# EAGLE schematic MethaneFlux - Copy (EAGLE 9.6.2)
Assembly variants: v1.0

## Sheet 1 of 2: Board 1- Power Module, Arduino MRK NB 1500, Methane Sensors (2600 2602 2611)
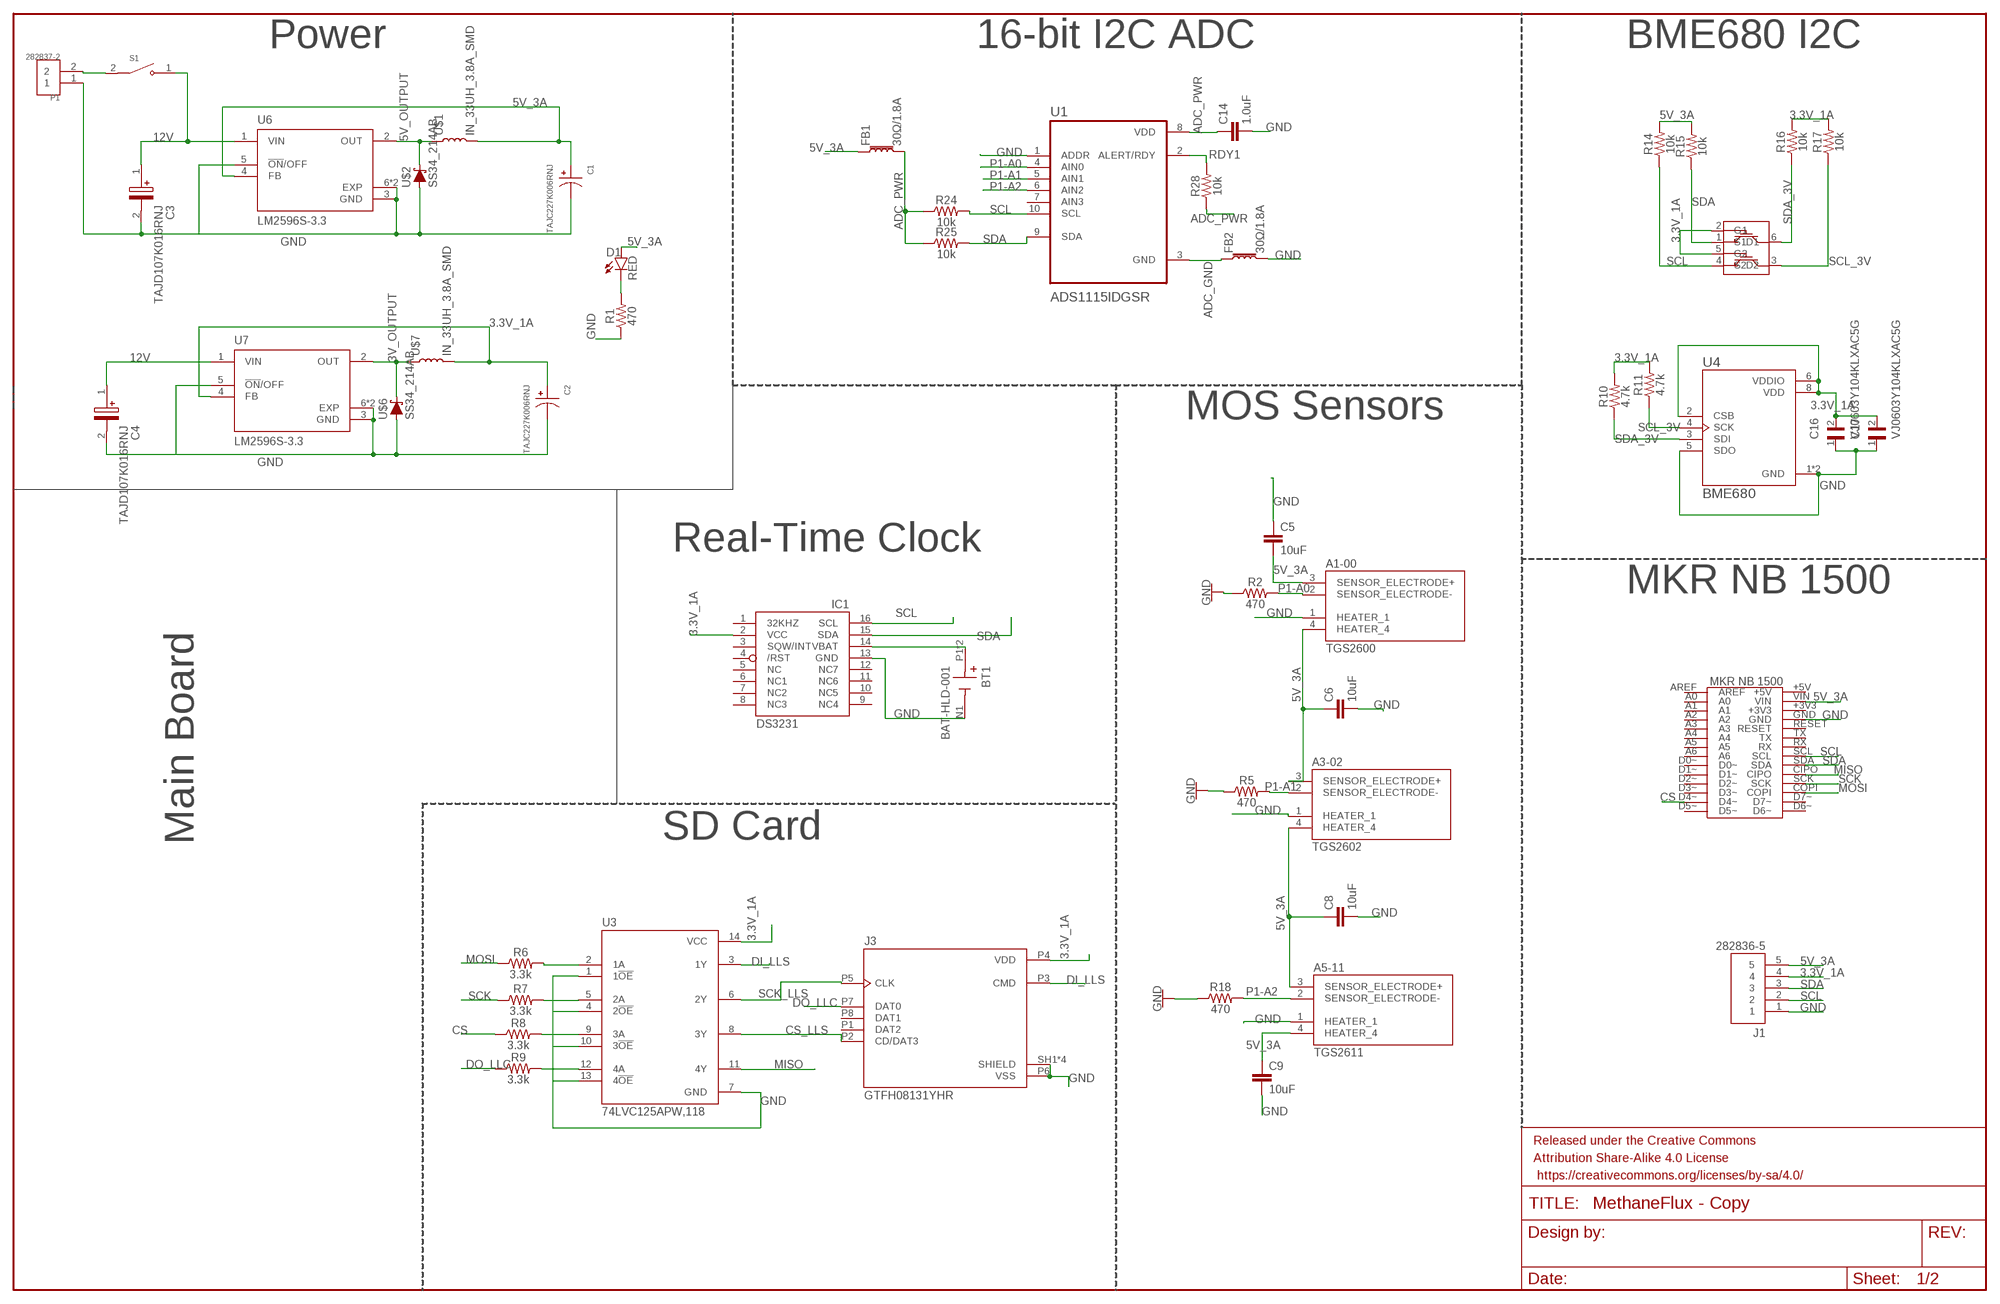
[diagram p0: schematic, sheet 1]

### Parts
A1-00  TGS2600  [TO255P920H830-4]
A3-02  TGS2602  [TGS2602]
A5-11  TGS2611  [TGS2611]
BT1  BAT-HLD-001  [BAT_BAT-HLD-001]
C1  TAJC227K006RNJ  [CAPPM6032X280N]
C2  TAJC227K006RNJ  [CAPPM6032X280N]
C3  TAJD107K016RNJ  [CAPPM7344X310N]
C4  TAJD107K016RNJ  [CAPPM7344X310N]
C5  10uF  10UF-0603-6.3V-20%  [0603]
C6  10uF  10UF-0603-6.3V-20%  [0603]
C8  10uF  10UF-0603-6.3V-20%  [0603]
C9  10uF  10UF-0603-6.3V-20%  [0603]
C14  1.0uF  1.0UF-0603-16V-10%  [0603]
C16  VJ0603Y104KLXAC5G  [CAPC1608X92N]
C17  VJ0603Y104KLXAC5G  [CAPC1608X92N]
D1  RED  LED-RED0603  [LED-0603]
FB1  30Ω/1.8A  FERRITE_BEAD-0603  [0603]
FB2  30Ω/1.8A  FERRITE_BEAD-0603  [0603]
FRAME1  FRAME-LEDGER  [CREATIVE_COMMONS]
IC1  DS3231/SO  [SO16W]
J1  282836-5  [TE_282836-5]
J3  GTFH08131YHR  [AMPHENOL_GTFH08131YHR]
P1  282837-2  [TE_282837-2]
R1  470  470OHM-0603-1/10W-1%  [0603]
R2  470  470OHM-0603-1/10W-1%  [0603]
R5  470  470OHM-0603-1/10W-1%  [0603]
R6  3.3k  3.3KOHM-0603-1/10W-1%  [0603]
R7  3.3k  3.3KOHM-0603-1/10W-1%  [0603]
R8  3.3k  3.3KOHM-0603-1/10W-1%  [0603]
R9  3.3k  3.3KOHM-0603-1/10W-1%  [0603]
R10  4.7k  4.7KOHM-0603-1/10W-1%  [0603]
R11  4.7k  4.7KOHM-0603-1/10W-1%  [0603]
R14  10k  10KOHM-0603-1/10W-1%  [0603]
R15  10k  10KOHM-0603-1/10W-1%  [0603]
R16  10k  10KOHM-0603-1/10W-1%  [0603]
R17  10k  10KOHM-0603-1/10W-1%  [0603]
R18  470  470OHM-0603-1/10W-1%  [0603]
R24  10k  10KOHM-0603-1/10W-1%  [0603]
R25  10k  10KOHM-0603-1/10W-1%  [0603]
R28  10k  10KOHM-0603-1/10W-1%  [0603]
S1  RB141C1100  [SW_RB141C1100]
U1  ADS1115IDGSR  [SOP50P490X110-10N]
U3  74LVC125APW,118  [IC_74LVC125APW,118]
U4  BME680  [PSON80P300X300X100-8N]
U6  LM2596S-3.3  [VREG_LM2596S-3.3]
U7  LM2596S-3.3  [VREG_LM2596S-3.3]
U$1  IN_33UH_3.8A_SMD  [INDUCTOR_4X4MM]
U$2  SS34_214AB  [SOD-323]
U$3  2N7002DW  [SOT363]
U$5  MKRNB1500  [MRKNB1500]
U$6  SS34_214AB  [SOD-323]
U$7  IN_33UH_3.8A_SMD  [INDUCTOR_4X4MM]

### Nets
3.3V_1A: C2.1 C16.2 C17.2 IC1.2(VCC) J1.4 J3.P4(VDD) R10.2 R11.2 R16.2 R17.2 U3.14(VCC) U4.2(CSB) U4.6(VDDIO) U4.8(VDD) U7.4(FB) U$3.2(G1) U$3.5(G2) U$7.P$2
3V_OUTPUT: U7.2(OUT) U$6.ANODE(C) U$7.P$1
5V_3A [5$3v3_3A]: A1-00.3(SENSOR_ELECTRODE+) A1-00.4(HEATER_4) A3-02.3(SENSOR_ELECTRODE+) A3-02.4(HEATER_4) A5-11.3(SENSOR_ELECTRODE+) A5-11.4(HEATER_4) C1.1 C5.2 C6.1 C8.1 C9.1 D1.A FB1.1 J1.5 R14.2 R15.2 U6.4(FB) U$1.P$2 U$5.VIN
5V_OUTPUT: U6.2(OUT) U$1.P$1 U$2.ANODE(C)
12V [PowerIn]: C3.1(+) C4.1(+) S1.1 U6.1(VIN) U7.1(VIN)
ADC_GND: FB2.1 U1.3(GND)
ADC_PWR: C14.1 FB1.2 R24.1 R25.1 R28.1 U1.8(VDD)
CS [SPI]: R8.1 U$5.D4~
CS_LLS [SPI]: J3.P2(CD/DAT3) U3.8(3Y)
DI_LLS [SPI]: J3.P3(CMD) U3.3(1Y)
DO_LLC [SPI]: J3.P7(DAT0) R9.1
GND [GND]: A1-00.1(HEATER_1) A3-02.1(HEATER_1) A5-11.1(HEATER_1) BT1.N1(-) C1.2 C2.2 C3.2(-) C4.2(-) C5.1 C6.2 C8.2 C9.2 C14.2 C16.1 C17.1 FB2.2 IC1.13(GND) J1.1 J3.P6(VSS) J3.SH1(SHIELD) J3.SH2(SHIELD) J3.SH3(SHIELD) J3.SH4(SHIELD) P1.1 R1.1 R2.1 R5.1 R18.1 U1.1(ADDR) U3.1(1!OE) U3.4(2!OE) U3.7(GND) U3.10(3!OE) U3.13(4!OE) U4.1(GND) U4.5(SDO) U4.7(GND) U6.3(GND) U6.5(!ON!/OFF) U6.6(EXP) U6.7(EXP) U7.3(GND) U7.5(!ON!/OFF) U7.6(EXP) U7.7(EXP) U$2.CATHODE(A) U$5.GND U$6.CATHODE(A)
MISO [SPI]: U3.11(4Y) U$5.CIPO
MOSI [SPI]: R6.1 U$5.COPI
N$3: R6.2 U3.2(1A)
N$4 [PowerIn]: P1.2 S1.2
N$6 [SPI]: R7.2 U3.5(2A)
N$7 [SPI]: R8.2 U3.9(3A)
N$8 [SPI]: R9.2 U3.12(4A)
N$10: BT1.P1(+) BT1.P2(+) IC1.14(VBAT)
N$11 [5$3v3_3A]: D1.C R1.2
P1-A0 [ADC]: A1-00.2(SENSOR_ELECTRODE-) R2.2 U1.4(AIN0)
P1-A1 [ADC]: A3-02.2(SENSOR_ELECTRODE-) R5.2 U1.5(AIN1)
P1-A2 [ADC]: A5-11.2(SENSOR_ELECTRODE-) R18.2 U1.6(AIN2)
RDY1: R28.2 U1.2(ALERT/RDY)
SCK [SPI]: R7.1 U$5.SCK
SCK_LLS [SPI]: J3.P5(CLK) U3.6(2Y)
SCL: IC1.16(SCL) J1.2 R14.1 R24.2 U1.10(SCL) U$3.4(S2) U$5.SCL
SCL_3V: R11.1 R17.1 U4.4(SCK) U$3.3(D2)
SDA: IC1.15(SDA) J1.3 R15.1 R25.2 U1.9(SDA) U$3.1(S1) U$5.SDA
SDA_3V: R10.1 R16.1 U4.3(SDI) U$3.6(D1)
Unconnected: IC1.1(32KHZ) IC1.3(SQW/INT) IC1.4(/RST) IC1.5(NC) IC1.6(NC1) IC1.7(NC2) IC1.8(NC3) IC1.9(NC4) IC1.10(NC5) IC1.11(NC6) IC1.12(NC7) J3.P1(DAT2) J3.P8(DAT1) U1.7(AIN3) U$5.+3V3 U$5.+5V U$5.A0 U$5.A1 U$5.A2 U$5.A3 U$5.A4 U$5.A5 U$5.A6 U$5.AREF U$5.D0~ U$5.D1~ U$5.D2~ U$5.D3~ U$5.D5~ U$5.D6~ U$5.D7~ U$5.RESET U$5.RX U$5.TX

### Notes on the sheet
- Power | 16-bit I2C ADC | BME680 I2C
- MOS Sensors
- Real-Time Clock
- MKR NB 1500
- Main Board | SD Card

## Sheet 2 of 2: Breakoff part to board 1- Methane Sensors (2600 2602 2611) and the ADC & BME
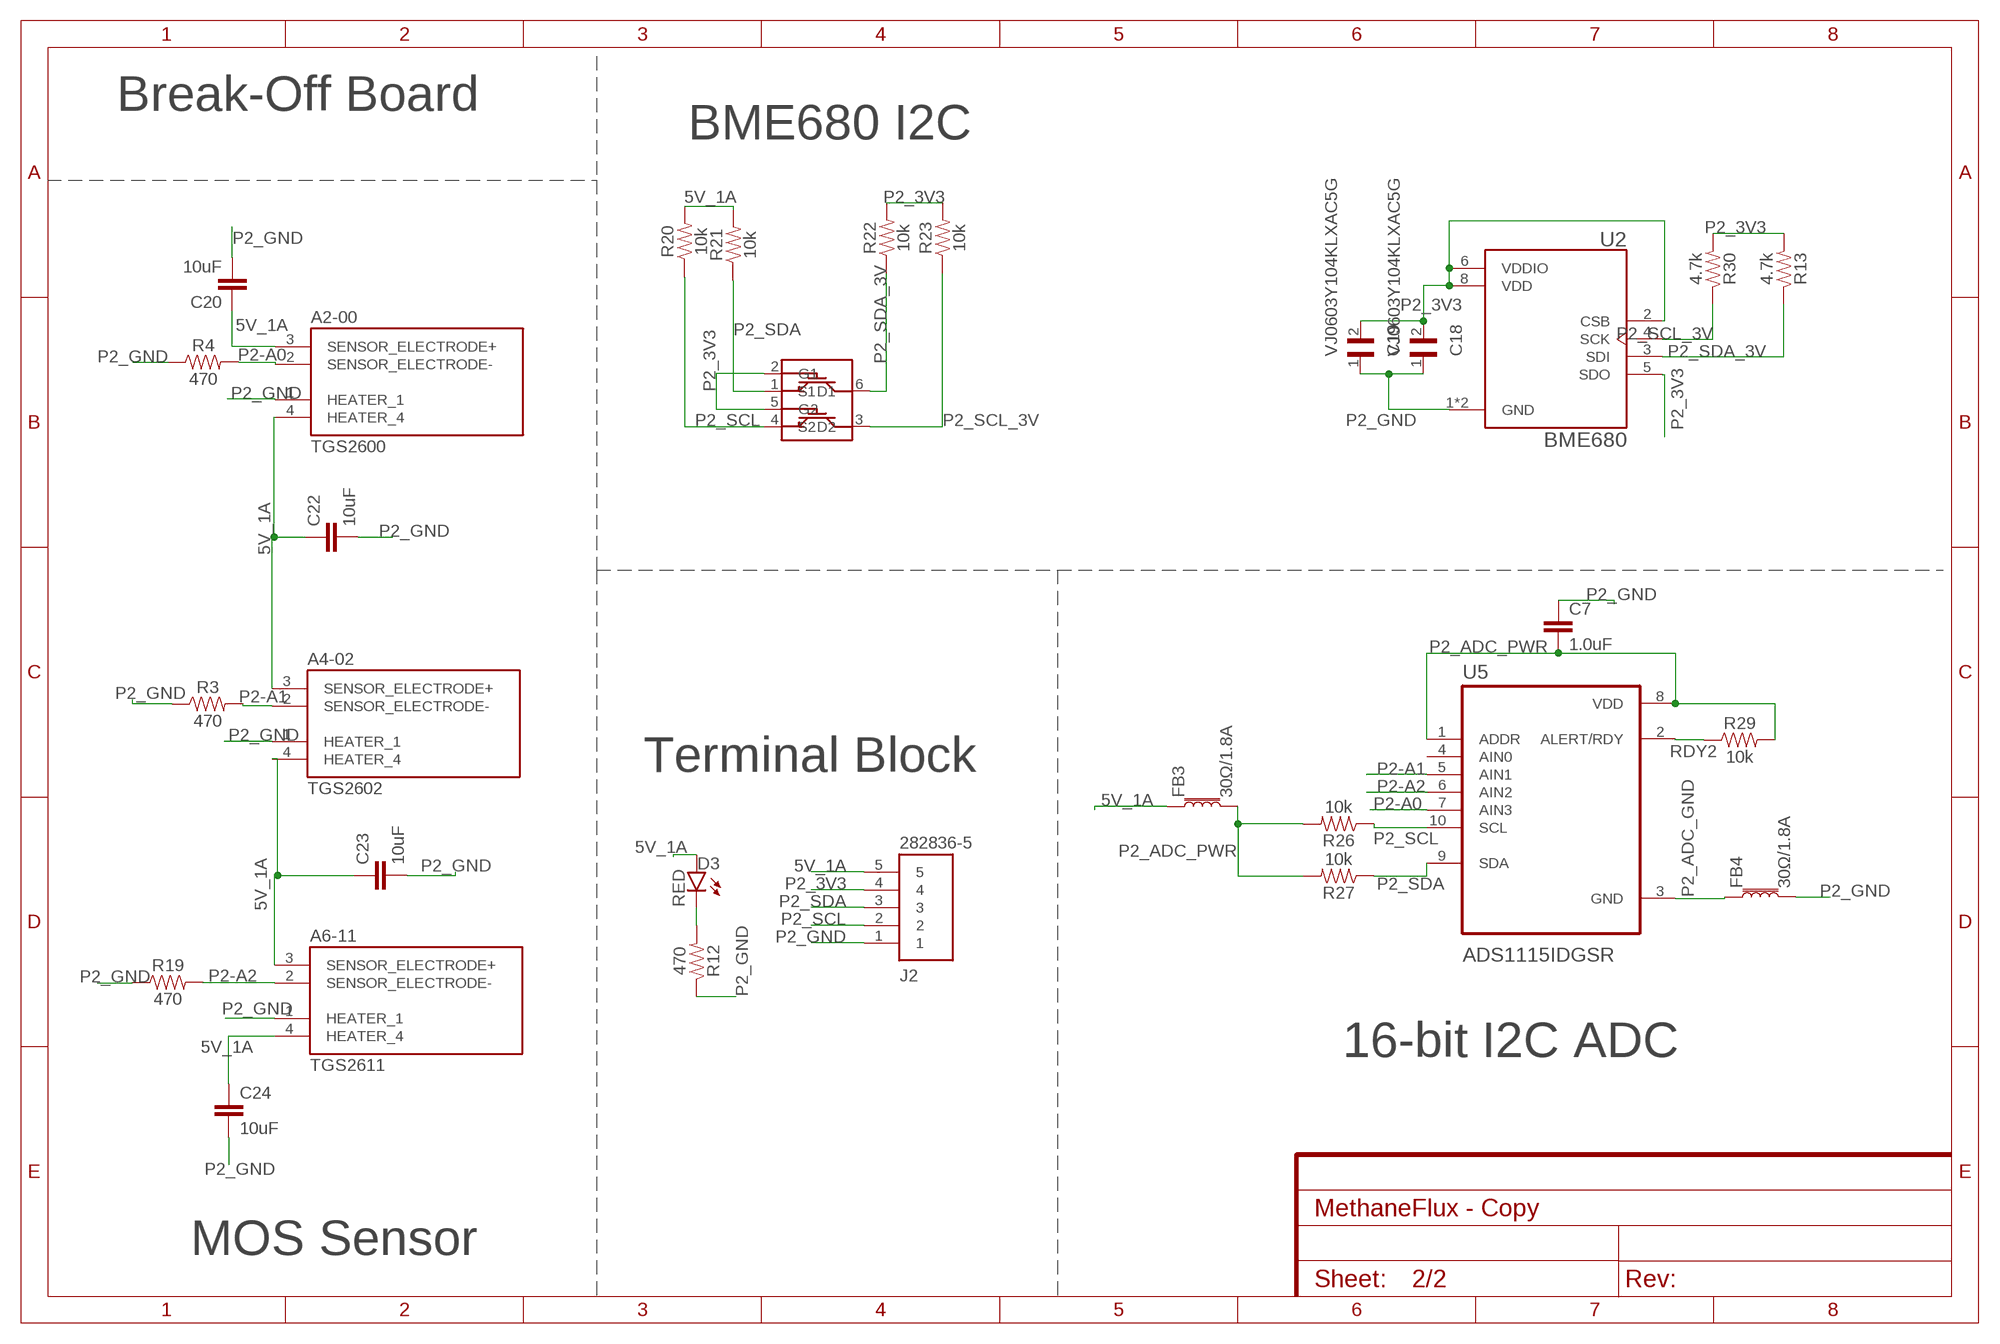
[diagram p1: schematic, sheet 2]

### Parts
A2-00  TGS2600  [TO255P920H830-4]
A4-02  TGS2602  [TGS2602]
A6-11  TGS2611  [TGS2611]
C7  1.0uF  1.0UF-0603-16V-10%  [0603]
C18  VJ0603Y104KLXAC5G  [CAPC1608X92N]
C19  VJ0603Y104KLXAC5G  [CAPC1608X92N]
C20  10uF  10UF-0603-6.3V-20%  [0603]
C22  10uF  10UF-0603-6.3V-20%  [0603]
C23  10uF  10UF-0603-6.3V-20%  [0603]
C24  10uF  10UF-0603-6.3V-20%  [0603]
D3  RED  LED-RED0603  [LED-0603]
FB3  30Ω/1.8A  FERRITE_BEAD-0603  [0603]
FB4  30Ω/1.8A  FERRITE_BEAD-0603  [0603]
J2  282836-5  [TE_282836-5]
R3  470  470OHM-0603-1/10W-1%  [0603]
R4  470  470OHM-0603-1/10W-1%  [0603]
R12  470  470OHM-0603-1/10W-1%  [0603]
R13  4.7k  4.7KOHM-0603-1/10W-1%  [0603]
R19  470  470OHM-0603-1/10W-1%  [0603]
R20  10k  10KOHM-0603-1/10W-1%  [0603]
R21  10k  10KOHM-0603-1/10W-1%  [0603]
R22  10k  10KOHM-0603-1/10W-1%  [0603]
R23  10k  10KOHM-0603-1/10W-1%  [0603]
R26  10k  10KOHM-0603-1/10W-1%  [0603]
R27  10k  10KOHM-0603-1/10W-1%  [0603]
R29  10k  10KOHM-0603-1/10W-1%  [0603]
R30  4.7k  4.7KOHM-0603-1/10W-1%  [0603]
U2  BME680  [PSON80P300X300X100-8N]
U5  ADS1115IDGSR  [SOP50P490X110-10N]
U$4  2N7002DW  [SOT363]

### Nets
5V_1A [P2_PWR]: A2-00.3(SENSOR_ELECTRODE+) A2-00.4(HEATER_4) A4-02.3(SENSOR_ELECTRODE+) A4-02.4(HEATER_4) A6-11.3(SENSOR_ELECTRODE+) A6-11.4(HEATER_4) C20.1 C22.1 C23.1 C24.1 D3.A FB3.1 J2.5 R20.2 R21.2
N$1 [5$3v3_3A]: D3.C R12.2
P2-A0 [ADC]: A2-00.2(SENSOR_ELECTRODE-) R4.2 U5.7(AIN3)
P2-A1 [ADC]: A4-02.2(SENSOR_ELECTRODE-) R3.2 U5.5(AIN1)
P2-A2 [ADC]: A6-11.2(SENSOR_ELECTRODE-) R19.2 U5.6(AIN2)
P2_3V3 [P2_PWR]: C18.2 C19.2 J2.4 R13.2 R22.2 R23.2 R30.2 U2.2(CSB) U2.5(SDO) U2.6(VDDIO) U2.8(VDD) U$4.2(G1) U$4.5(G2)
P2_ADC_GND: FB4.1 U5.3(GND)
P2_ADC_PWR: C7.2 FB3.2 R26.2 R27.2 R29.2 U5.1(ADDR) U5.8(VDD)
P2_GND [P2_GND]: A2-00.1(HEATER_1) A4-02.1(HEATER_1) A6-11.1(HEATER_1) C7.1 C18.1 C19.1 C20.2 C22.2 C23.2 C24.2 FB4.2 J2.1 R3.1 R4.1 R12.1 R19.1 U2.1(GND) U2.7(GND)
P2_SCL: J2.2 R20.1 R26.1 U5.10(SCL) U$4.4(S2)
P2_SCL_3V: R23.1 R30.1 U2.4(SCK) U$4.3(D2)
P2_SDA: J2.3 R21.1 R27.1 U5.9(SDA) U$4.1(S1)
P2_SDA_3V: R13.1 R22.1 U2.3(SDI) U$4.6(D1)
RDY2: R29.1 U5.2(ALERT/RDY)
Unconnected: U5.4(AIN0)

### Notes on the sheet
- Break-Off Board
- BME680 I2C
- Terminal Block
- 16-bit I2C ADC
- MOS Sensor

## Library data of the parts
A1-00 A2-00 = TGS2600:TGS2600: Check availability <https://pricing.snapeda.com/parts/TGS2600/Figaro/view-part?ref=eda>; AVAILABILITY: In Stock; CHECK_PRICES: https://www.snapeda.com/parts/TGS2600/Figaro/view-part/?ref=eda; DESCRIPTION: Gas sensor [Figaro] TGS2600 Gas sensor; MF: Figaro; MP: TGS2600; PACKAGE: None; PRICE: None; SNAPEDA_LINK: https://www.snapeda.com/parts/TGS2600/Figaro/view-part/?ref=snap
A3-02 A4-02 = TGS2600:TGS2602
A5-11 A6-11 = TGS2600:TGS2611
BT1 = BAT-HLD-001:BAT-HLD-001: Battery Retainer Coin, 20.0mm 1 Cell SMD (SMT) Tab Check availability <https://pricing.snapeda.com/parts/BAT-HLD-001/Linx%20Technologies/view-part?ref=eda>; AVAILABILITY: In Stock; CHECK_PRICES: https://www.snapeda.com/parts/BAT-HLD-001/Linx+Technologies+Inc./view-part/?ref=eda; DESCRIPTION: Holder for CR2032 and CR2025 Batteries, Surface-Mount, Bulk Packaging; MF: Linx Technologies; MP: BAT-HLD-001; PACKAGE: None; PRICE: None; PURCHASE-URL: https://www.snapeda.com/api/url_track_click_mouser/?unipart_id=184402&manufacturer=Linx Technologies&part_name=BAT-HLD-001&search_term=cr2032 battery holder; SNAPEDA_LINK: https://www.snapeda.com/parts/BAT-HLD-001/Linx+Technologies+Inc./view-part/?ref=snap
C1 C2 = TAJC227K006RNJ:TAJC227K006RNJ: 220µF Molded Tantalum Capacitors 16V 2312 (6032 Metric) 500mOhm; CHECK_PRICES: https://www.snapeda.com/parts/TAJC227K006RNJ/Kyocera/view-part/?ref=eda; DESCRIPTION: Cap Tant Solid 220uF 6.3V C CASE 10% (6 X 3.2 X 2.6mm) Inward L SMD 6032-28 1.2 Ohm 125°C T/R; DIGIKEY_PART_NUMBER: 478-1713-2-ND; MF: KYOCERA AVX; MP: TAJC227K006RNJ; PACKAGE: None; PURCHASE-URL: https://www.snapeda.com/api/url_track_click_mouser/?unipart_id=11870375&manufacturer=KYOCERA AVX&part_name=TAJC227K006RNJ&search_term=tajc227k006rnj; SNAPEDA_LINK: https://www.snapeda.com/parts/TAJC227K006RNJ/Kyocera/view-part/?ref=snap
C3 C4 = TAJD107K016RNJ:TAJD107K016RNJ: TAJ SMT tant capacitor,Case D,16V,100uF AVX 100uF SMD Solid MnO2 Tantalum Electrolytic Capacitor, 16 V dc /-10%, TAJ Series Source: Datasheet <http://datasheets.avx.com/TAJ.pdf>; CHECK_PRICES: https://www.snapeda.com/parts/TAJD107K016RNJ/AVX/view-part/?ref=eda; DESCRIPTION: Capacitor;Tantalum;Cap 100 uF;Tol 10%;Vol-Rtg 16 VDC;SMT;7343;ESR 0.9 Ohms;TR | AVX TAJD107K016RNJ; MF: AVX; MP: TAJD107K016RNJ; PACKAGE: 2917 AVX; RS_COMPONENTS_70001054_PURCHASE_URL: https://www.snapeda.com/api/url_track_click/https%253A//us.rs-online.com/product/avx/tajd107k016rnj/70001054/%253Futm_source%253DSnapEDA%2526utm_medium%253Dpart_sourcing%2526utm_campaign%253Dpartsourcing_SnapEDA_IMP_EX_GR/?unipart_id=320527&manufacturer=AVX&part_name=TAJD107K016RNJ&search_term=tajd107k016rnj; SNAPEDA_LINK: https://www.snapeda.com/parts/TAJD107K016RNJ/AVX/view-part/?ref=snap
C5 C6 C8 C9 C20 C22-C24 = SparkFun-Capacitors:10UF: 10.0µF ceramic capacitors A capacitor is a passive two-terminal electrical component used to store electrical energy temporarily in an electric field.; PROD_ID: CAP-11015
C7 C14 = SparkFun-Capacitors:1.0UF: 1µF ceramic capacitors A capacitor is a passive two-terminal electrical component used to store electrical energy temporarily in an electric field.; PROD_ID: CAP-00868
C16-C19 = VJ0603Y104KLXAC5G:VJ0603Y104KLXAC5G: Multilayer Ceramic Capacitors MLCC - SMD/SMT 100nF 25volts 10% Check availability <https://pricing.snapeda.com/parts/VJ0603Y104KLXAC5G/Vishay/view-part?ref=eda>; AVAILABILITY: In Stock; CHECK_PRICES: https://www.snapeda.com/parts/VJ0603Y104KLXAC5G/Vishay/view-part/?ref=eda; DESCRIPTION: Multilayer Ceramic Capacitors MLCC - SMD/SMT 100nF 25volts 10%; MF: Vishay; MP: VJ0603Y104KLXAC5G; PACKAGE: 0603 Vishay; PRICE: None; SNAPEDA_LINK: https://www.snapeda.com/parts/VJ0603Y104KLXAC5G/Vishay/view-part/?ref=snap
D1 D3 = SparkFun-LED:LED-RED: Red SMD LED Used in manufacturing of most products at SparkFun Packages: 0603 - SMD 0603 package [Product Link] <http://docs.avagotech.com/docs/AV02-0551EN> 0603 SMART - SMD 0603 SMART package ( more efficient and expensive)[Product Link] <http://www.osram-os.com/Graphics/XPic2/00077099_0.pdf> 1206 - SMD1206 package [Product Link] <https://www.sparkfun.com/datasheets/DevTools/LilyPad/Q150OVS4.pdff> SparkFun Products: Pro Mini 328 -5V <https://www.sparkfun.com/products/821> RedBoard <https://www.sparkfun.com/products/12757> IOIO-OTG <https://www.sparkfun.com/products/13613>; PROD_ID: DIO-00819
FB1-FB4 = SparkFun-Coils:FERRITE_BEAD: Ferrite Bead (blocks, cores, rings, chokes, etc.) Inductor with layers of ferrite used to suppress high frequencies. Often used to isolate high frequency noise. SparkFun Products: IOIO-OTG - V2.2 <https://www.sparkfun.com/products/13613> SparkFun SAMD21 Mini Breakout <https://www.sparkfun.com/products/13664> SparkFun 6 Degrees of Freedom Breakout - LSM6DS3 <https://www.sparkfun.com/products/13339> SparkFun SAMD21 Dev Breakout <https://www.sparkfun.com/products/13672>; PROD_ID: NDUC-13805
FRAME1 = SparkFun-Aesthetics:FRAME-LEDGER: Schematic Frame - Ledger Standard 11x14 US Ledger frame
IC1 = DS3231:DS3231: Check availability <https://pricing.snapeda.com/parts/DS3231/Analog%20Devices/view-part?ref=eda>; AVAILABILITY: In Stock; CHECK_PRICES: https://www.snapeda.com/parts/DS3231/Analog+Devices/view-part/?ref=eda; DESCRIPTION: Real Time Clock (RTC) IC Clock/Calendar - I²C, 2-Wire Serial 8-SOIC (0.154, 3.90mm Width); MF: Analog Devices; MP: DS3231; PACKAGE: SOIC-16 Maxim Integrated; PRICE: None; PURCHASE-URL: https://www.snapeda.com/api/url_track_click_mouser/?unipart_id=553791&manufacturer=Analog Devices&part_name=DS3231&search_term=ds3231; SNAPEDA_LINK: https://www.snapeda.com/parts/DS3231/Analog+Devices/view-part/?ref=snap
J1 J2 = 282836-5:282836-5: Check availability <https://pricing.snapeda.com/parts/282836-5/TE%20Connectivity/view-part?ref=eda>; AVAILABILITY: In Stock; CHECK_PRICES: https://www.snapeda.com/parts/282836-5/TE+Connectivity+AMP+Connectors/view-part/?ref=eda; COMMENT: 282836-5; DESCRIPTION: 5 Position Wire to Board Terminal Block Horizontal with Board 0.197 (5.00mm) Through Hole; EU_ROHS_COMPLIANCE: Compliant with Exemptions; MF: TE Connectivity; MP: 282836-5; PACKAGE: None; PRICE: None; PURCHASE-URL: https://www.snapeda.com/api/url_track_click_mouser/?unipart_id=417471&manufacturer=TE Connectivity&part_name=282836-5&search_term=282836-5; SNAPEDA_LINK: https://www.snapeda.com/parts/282836-5/TE+Connectivity+AMP+Connectors/view-part/?ref=snap
J3 = GTFH08131YHR:GTFH08131YHR: Check availability <https://pricing.snapeda.com/parts/GTFH08131YHR/Amphenol%20ICC/view-part?ref=eda>; AVAILABILITY: In Stock; CHECK_PRICES: https://www.snapeda.com/parts/GTFH08131YHR/Amphenol+FCI/view-part/?ref=eda; DESCRIPTION: Micro SD and SD Card Sockets, Input Output Connectors, Micro SD Socket, 8 Position, Hinge Type Right Angle SMT, LCP Black; MF: Amphenol ICC; MP: GTFH08131YHR; PACKAGE: None; PRICE: None; PURCHASE-URL: https://www.snapeda.com/api/url_track_click_mouser/?unipart_id=3603870&manufacturer=Amphenol ICC&part_name=GTFH08131YHR&search_term=micro sd socket; SNAPEDA_LINK: https://www.snapeda.com/parts/GTFH08131YHR/Amphenol+FCI/view-part/?ref=snap
P1 = 282837-2:282837-2: TERM BLOCK 5.08MM 2POS SIDE ENTY Check availability <https://pricing.snapeda.com/parts/282837-2/TE%20Connectivity/view-part?ref=eda>; AVAILABILITY: In Stock; CHECK_PRICES: https://www.snapeda.com/parts/282837-2/TE+Connectivity+AMP+Connectors/view-part/?ref=eda; COMMENT: 282837-2; DESCRIPTION: Terminal Block Connector Wire Receptacle 2 5.08 mm 30-16 AWG Green 13.5 A 250 V | TE Connectivity 282837-2; MF: TE Connectivity; MP: 282837-2; PACKAGE: None; PRICE: None; PURCHASE-URL: https://www.snapeda.com/api/url_track_click_mouser/?unipart_id=2549980&manufacturer=TE Connectivity&part_name=282837-2&search_term=None; SNAPEDA_LINK: https://www.snapeda.com/parts/282837-2/TE+Connectivity+AMP+Connectors/view-part/?ref=snap
R1-R5 R12 R18 R19 = SparkFun-Resistors:470OHM: 470Ω resistor A resistor is a passive two-terminal electrical component that implements electrical resistance as a circuit element. Resistors act to reduce current flow, and, at the same time, act to lower voltage levels within circuits. - Wikipedia; PROD_ID: RES-07869
R6-R9 = SparkFun-Resistors:3.3KOHM: 3.3kΩ resistor A resistor is a passive two-terminal electrical component that implements electrical resistance as a circuit element. Resistors act to reduce current flow, and, at the same time, act to lower voltage levels within circuits. - Wikipedia; PROD_ID: RES-07851
R10 R11 R13 R30 = SparkFun-Resistors:4.7KOHM: 4.7kΩ resistor A resistor is a passive two-terminal electrical component that implements electrical resistance as a circuit element. Resistors act to reduce current flow, and, at the same time, act to lower voltage levels within circuits. - Wikipedia; PROD_ID: RES-07857
R14-R17 R20-R29 = SparkFun-Resistors:10KOHM: 10kΩ resistor A resistor is a passive two-terminal electrical component that implements electrical resistance as a circuit element. Resistors act to reduce current flow, and, at the same time, act to lower voltage levels within circuits. - Wikipedia; PROD_ID: RES-00824
S1 = RB141C1100:RB141C1100: Swicth SPST RB141C1100 Check availability <https://pricing.snapeda.com/parts/RB141C1100/E-Switch/view-part?ref=eda>; AVAILABILITY: In Stock; CHECK_PRICES: https://www.snapeda.com/parts/RB141C1100/E-Switch/view-part/?ref=eda; DESCRIPTION: Rocker Switch, RB1 Series, SPST, ON-OFF, Non-Illum, Black, 15A, 125VAC, QC | E-Switch RB141C1100; MF: E-Switch; MP: RB141C1100; PACKAGE: None; PRICE: None; PURCHASE-URL: https://www.snapeda.com/api/url_track_click_mouser/?unipart_id=4449618&manufacturer=E-Switch&part_name=RB141C1100&search_term=rs-001g-a-bb-4; SNAPEDA_LINK: https://www.snapeda.com/parts/RB141C1100/E-Switch/view-part/?ref=snap
U1 U5 = ADS1115IDGSR:ADS1115IDGSR: Check availability <https://pricing.snapeda.com/parts/ADS1115IDGSR/Texas%20Instruments/view-part?ref=eda>; AVAILABILITY: In Stock; CHECK_PRICES: https://www.snapeda.com/parts/ADS1115IDGSR/Texas+Instruments/view-part/?ref=eda; DESCRIPTION: 16-bit, 860-SPS, 4-channel, delta-sigma ADC with PGA, oscillator, VREF, comparator and I2C; MF: Texas Instruments; MP: ADS1115IDGSR; PACKAGE: VSSOP-10 Texas Instruments; PRICE: None; PURCHASE-URL: https://www.snapeda.com/api/url_track_click_mouser/?unipart_id=45903&manufacturer=Texas Instruments&part_name=ADS1115IDGSR&search_term=ads1115idgsr; SNAPEDA_LINK: https://www.snapeda.com/parts/ADS1115IDGSR/Texas+Instruments/view-part/?ref=snap
U2 U4 = BME680:BME680: Integrated Environmental Unit Check availability <https://pricing.snapeda.com/parts/BME680/Bosch%20Sensortec/view-part?ref=eda>; AVAILABILITY: In Stock; CHECK_PRICES: https://www.snapeda.com/parts/BME680/Bosch+Sensortec/view-part/?ref=eda; DESCRIPTION: Gas, Humidity, Pressure, Temperature Sensor I²C, SPI Output; MF: Bosch Sensortec; MP: BME680; PACKAGE: LGA-8 Bosch Tools; PRICE: None; PURCHASE-URL: https://www.snapeda.com/api/url_track_click_mouser/?unipart_id=947201&manufacturer=Bosch Sensortec&part_name=BME680&search_term=bme680; SNAPEDA_LINK: https://www.snapeda.com/parts/BME680/Bosch+Sensortec/view-part/?ref=snap
U3 = 74LVC125APW_118:74LVC125APW,118: Check availability <https://pricing.snapeda.com/parts/74LVC125APW%2C118/Nexperia%20USA%20Inc./view-part?ref=eda> Check availability <https://pricing.snapeda.com/parts/74LVC125APW%2C118/Nexperia%20USA%20Inc./view-part?ref=eda> Check availability <https://pricing.snapeda.com/parts/74LVC125APW%2C118/Nexperia%20USA%20Inc./view-part?ref=eda>; AVAILABILITY: In Stock; CHECK_PRICES: https://www.snapeda.com/parts/74LVC125APW,118/Nexperia/view-part/?ref=eda; DESCRIPTION: Buffer, Non-Inverting 4 Element 1 Bit per Element 3-State Output 14-TSSOP; MF: Nexperia USA Inc.; MP: 74LVC125APW,118; PACKAGE: TSSOP14-14 Nexperia USA Inc.; PRICE: None; PURCHASE-URL: https://www.snapeda.com/api/url_track_click_mouser/?unipart_id=5248541&manufacturer=Nexperia USA Inc.&part_name=74LVC125APW,118&search_term=74lvc125apw; SNAPEDA_LINK: https://www.snapeda.com/parts/74LVC125APW,118/Nexperia/view-part/?ref=snap
U6 U7 = LM2596S-3.3:LM2596S-3.3: Conv DC-DC 4.5V to 40V Inv/Step Down Single-Out 3.3V 3A 6-Pin(5+Tab) TO-263 Tube Check availability <https://pricing.snapeda.com/parts/LM2596S-3.3/Texas%20Instruments/view-part?ref=eda>; AVAILABILITY: In Stock; DESCRIPTION: SIMPLE SWITCHER&reg; 4.5V to 40V, 3A Low Component Count Step-Down Regulator 5-DDPAK/TO-263; MF: Texas Instruments; MP: LM2596S-3.3; PACKAGE: TO-263-5 Texas Instruments; PRICE: None; PURCHASE-URL: https://pricing.snapeda.com/search/part/LM2596S-3.3/?ref=eda
U$1 U$7 = SV_Inductors:IN_33UH_3.8A_SMD
U$2 U$6 = SV_Diode:SS34_214AB
U$3 U$4 = 2N7002DW:2N7002DW: Check availability <https://pricing.snapeda.com/parts/2N7002DW/onsemi/view-part?ref=eda>; AVAILABILITY: In Stock; CHECK_PRICES: https://www.snapeda.com/parts/2N7002DW/Onsemi/view-part/?ref=eda; DESCRIPTION: Mosfet Array 60V 115mA 200mW Surface Mount SC-88 (SC-70-6); MF: onsemi; MP: 2N7002DW; PACKAGE: SC-88-6 ON Semiconductor; PRICE: None; PURCHASE-URL: https://www.snapeda.com/api/url_track_click_mouser/?unipart_id=7265289&manufacturer=onsemi&part_name=2N7002DW&search_term=2n7002dw; SNAPEDA_LINK: https://www.snapeda.com/parts/2N7002DW/Onsemi/view-part/?ref=snap
U$5 = MKRNB1500:MKRNB1500: Double check before printing that this layout is right.

## Net classes
0 I2C: width 0.229 mm, clearance 0.003 mm
1 ADC: width 0.305 mm, clearance 0.1 mm
2 PowerIn: width 1.524 mm, clearance 0.003 mm
3 5$3v3_3A: width 1.016 mm, clearance 0.003 mm
5 GND: width 0.025 mm, clearance 0.003 mm
6 P2_GND: width 0.025 mm, clearance 0.003 mm